# Altium schematic sheet 5-Wifi.SchDoc
size A4; SheetNumber: 5; SheetTotal: 5
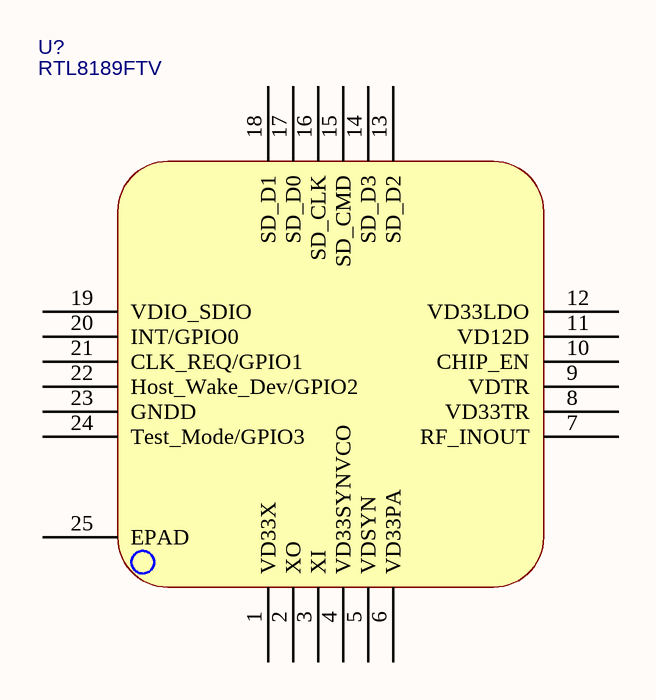
[diagram p0: 5-Wifi.SchDoc]

## Parts
U?  RTL8189FTV  [QFN24-0404-.5]

## Nets

Not connected (* = marked no-connect by the designer): U? 1(VD33X) 2(XO) 3(XI) 4(VD33SYNVCO) 5(VDSYN) 6(VD33PA) 7(RF_INOUT) 8(VD33TR) 9(VDTR) 10(CHIP_EN) 11(VD12D) 12(VD33LDO) 13(SD_D2) 14(SD_D3) 15(SD_CMD) 16(SD_CLK) 17(SD_D0) 18(SD_D1) 19(VDIO_SDIO) 20(INT/GPIO0) 21(CLK_REQ/GPIO1) 22(Host_Wake_Dev/GPIO2) 23(GNDD) 24(Test_Mode/GPIO3) 25(EPAD)

## Library data of the parts
U? = RTL8189FTV: Contributor: Pythoniot; spicePre: U; spiceSymbolName: RTL8189FTV